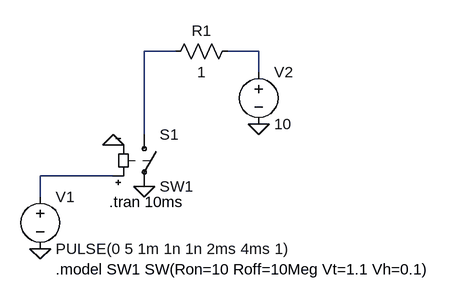
[diagram p0: schematic Draft7.asc]
Draft7.asc, the LTspice schematic file:
Version 4
SHEET 1 880 680
WIRE 176 -16 128 -16
WIRE 304 -16 256 -16
WIRE 304 16 304 -16
WIRE 128 112 128 -16
WIRE 80 176 -32 176
WIRE -32 208 -32 176
FLAG 128 192 0
FLAG 80 128 0
FLAG 304 96 0
FLAG -32 288 0
SYMBOL sw 128 96 R0
SYMATTR InstName S1
SYMATTR Value SW1
SYMBOL voltage -32 192 R0
WINDOW 123 0 0 Left 2
WINDOW 39 0 0 Left 2
SYMATTR InstName V1
SYMATTR Value PULSE(0 5 1m 1n 1n 2ms 4ms 1)
SYMBOL voltage 304 0 R0
WINDOW 123 0 0 Left 2
WINDOW 39 0 0 Left 2
SYMATTR InstName V2
SYMATTR Value 10
SYMBOL res 272 -32 R90
WINDOW 0 0 56 VBottom 2
WINDOW 3 32 56 VTop 2
SYMATTR InstName R1
SYMATTR Value 1
TEXT 74 216 Left 2 !.tran 10ms
TEXT -8 320 Left 2 !.model SW1 SW(Ron=10 Roff=10Meg Vt=1.1 Vh=0.1)

The netlist it stands for:
* Draft7.asc
S1 N001 0 N003 0 SW1
V1 N003 0 PULSE(0 5 1m 1n 1n 2ms 4ms 1)
V2 N002 0 10
R1 N002 N001 1
.tran 10ms
.model SW1 SW(Ron=10 Roff=10Meg Vt=1.1 Vh=0.1)
.backanno
.end